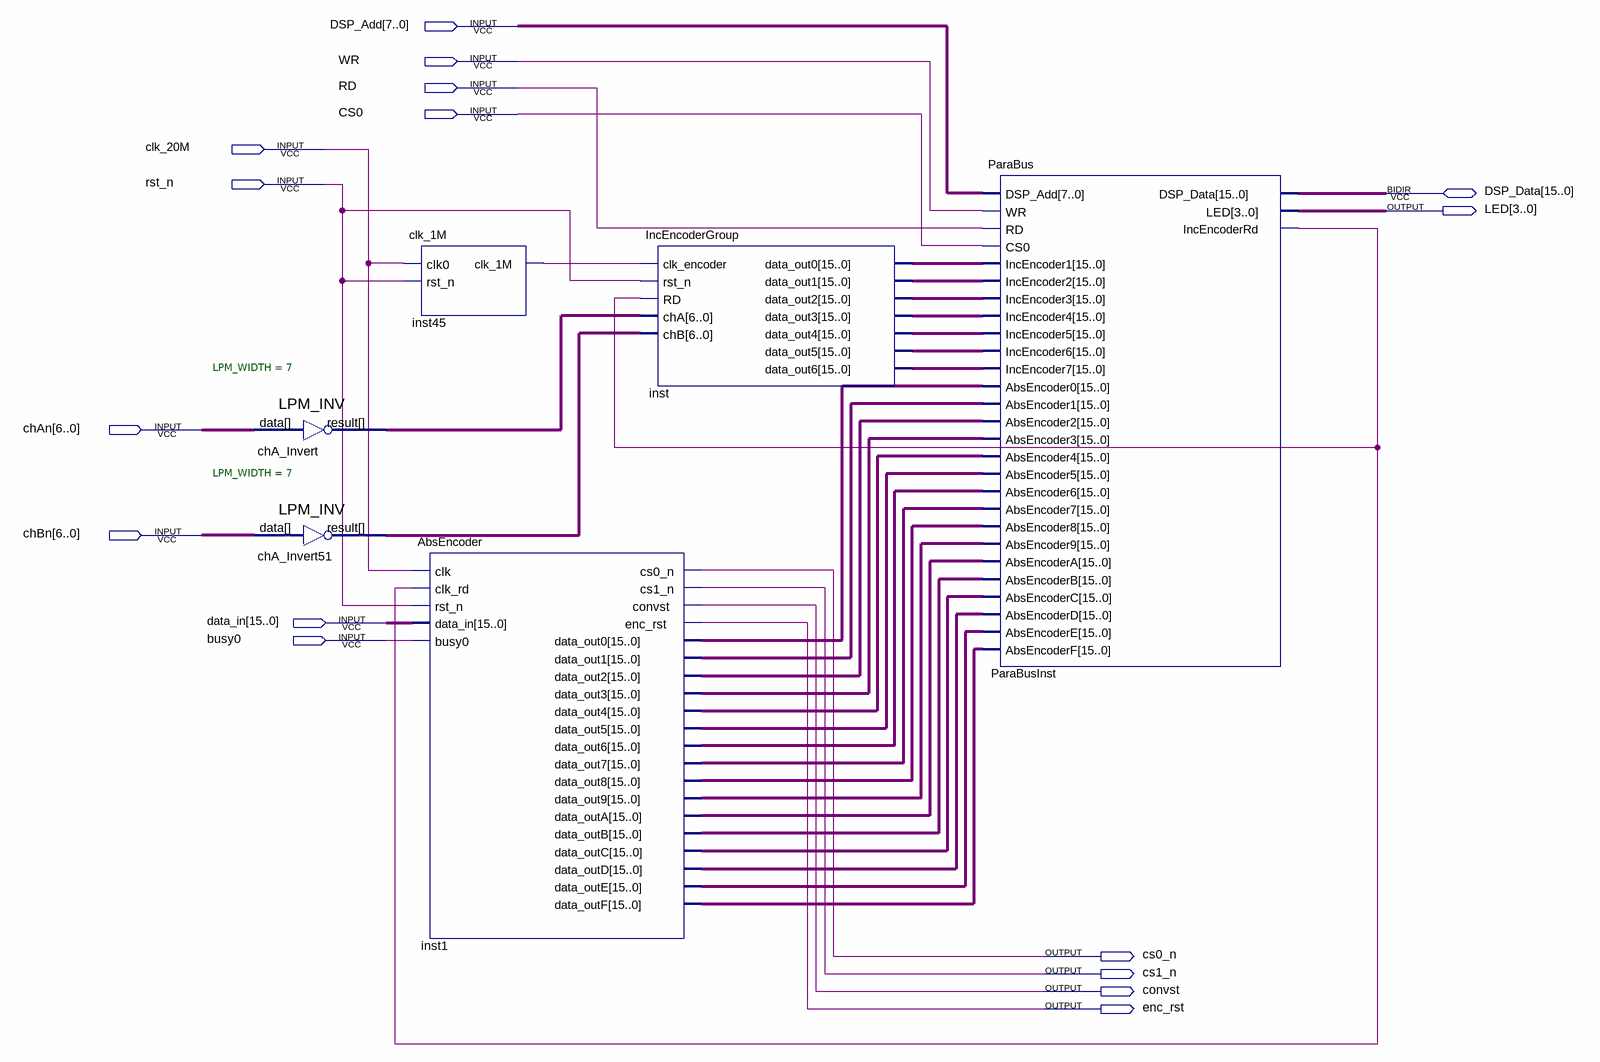
[diagram p0: schematic sheet]
// Quartus schematic sample_dsp.bdf as structural Verilog: 6 symbols, 16 pins
module sample_dsp (
  input  [7:0] DSP_Add,
  input  WR,
  input  RD,
  input  CS0,
  input  clk_20M,
  input  rst_n,
  input  [6:0] chAn,
  input  [6:0] chBn,
  input  [15:0] data_in,
  input  busy0,
  inout  [15:0] DSP_Data,
  output [3:0] LED,
  output cs0_n,
  output cs1_n,
  output convst,
  output enc_rst
);

  wire inst45_clk_1m, ParaBusInst_incencoderrd;
  wire [6:0] chA_Invert51_result, chA_Invert_result;
  wire [15:0] inst1_data_out0, inst1_data_out1, inst1_data_out2, inst1_data_out3, inst1_data_out4,
       inst1_data_out5, inst1_data_out6, inst1_data_out7, inst1_data_out8, inst1_data_out9, inst1_data_outa,
       inst1_data_outb, inst1_data_outc, inst1_data_outd, inst1_data_oute, inst1_data_outf, inst_data_out0,
       inst_data_out1, inst_data_out2, inst_data_out3, inst_data_out4, inst_data_out5, inst_data_out6;

  LPM_INV #(.LPM_WIDTH(7)) chA_Invert (.data(chAn), .result(chA_Invert_result));
  LPM_INV #(.LPM_WIDTH(7)) chA_Invert51 (.data(chBn), .result(chA_Invert51_result));
  clk_1M inst45 (.clk0(clk_20M), .rst_n(rst_n), .clk_1M(inst45_clk_1m));
  AbsEncoder inst1 (
    .clk(clk_20M), .clk_rd(ParaBusInst_incencoderrd), .rst_n(rst_n), .data_in(data_in), .busy0(busy0),
    .cs0_n(cs0_n), .cs1_n(cs1_n), .convst(convst), .enc_rst(enc_rst), .data_out0(inst1_data_out0),
    .data_out1(inst1_data_out1), .data_out2(inst1_data_out2), .data_out3(inst1_data_out3),
    .data_out4(inst1_data_out4), .data_out5(inst1_data_out5), .data_out6(inst1_data_out6),
    .data_out7(inst1_data_out7), .data_out8(inst1_data_out8), .data_out9(inst1_data_out9),
    .data_outA(inst1_data_outa), .data_outB(inst1_data_outb), .data_outC(inst1_data_outc),
    .data_outD(inst1_data_outd), .data_outE(inst1_data_oute), .data_outF(inst1_data_outf));
  IncEncoderGroup inst (
    .clk_encoder(inst45_clk_1m), .rst_n(rst_n), .RD(ParaBusInst_incencoderrd), .chA(chA_Invert_result),
    .chB(chA_Invert51_result), .data_out0(inst_data_out0), .data_out1(inst_data_out1),
    .data_out2(inst_data_out2), .data_out3(inst_data_out3), .data_out4(inst_data_out4),
    .data_out5(inst_data_out5), .data_out6(inst_data_out6));
  ParaBus ParaBusInst (
    .DSP_Add(DSP_Add), .WR(WR), .RD(RD), .CS0(CS0), .IncEncoder1(inst_data_out0),
    .IncEncoder2(inst_data_out1), .IncEncoder3(inst_data_out2), .IncEncoder4(inst_data_out3),
    .IncEncoder5(inst_data_out4), .IncEncoder6(inst_data_out5), .IncEncoder7(inst_data_out6),
    .AbsEncoder0(inst1_data_out0), .AbsEncoder1(inst1_data_out1), .AbsEncoder2(inst1_data_out2),
    .AbsEncoder3(inst1_data_out3), .AbsEncoder4(inst1_data_out4), .AbsEncoder5(inst1_data_out5),
    .AbsEncoder6(inst1_data_out6), .AbsEncoder7(inst1_data_out7), .AbsEncoder8(inst1_data_out8),
    .AbsEncoder9(inst1_data_out9), .AbsEncoderA(inst1_data_outa), .AbsEncoderB(inst1_data_outb),
    .AbsEncoderC(inst1_data_outc), .AbsEncoderD(inst1_data_outd), .AbsEncoderE(inst1_data_oute),
    .AbsEncoderF(inst1_data_outf), .LED(LED), .IncEncoderRd(ParaBusInst_incencoderrd), .DSP_Data(DSP_Data));
endmodule
